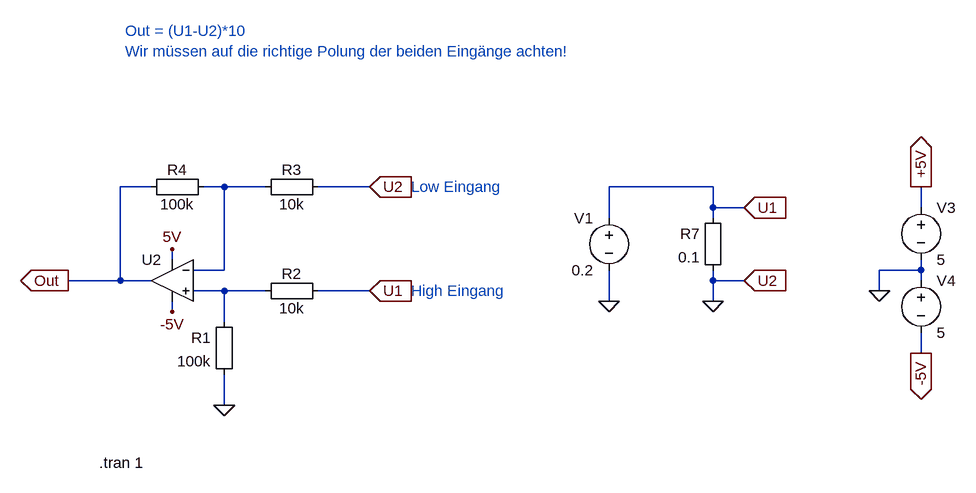
[diagram p0: schematic Differenzverstärker.asc]
Differenzverstärker.asc, the LTspice schematic file:
Version 4.1
SHEET 1 920 964
WIRE -336 -48 -384 -48
WIRE -224 -48 -256 -48
WIRE -160 -48 -224 -48
WIRE 0 -48 -80 -48
WIRE 528 -48 368 -48
WIRE 528 -16 528 -48
WIRE 576 -16 528 -16
WIRE 848 -16 848 -48
WIRE 368 0 368 -48
WIRE 528 0 528 -16
WIRE -304 64 -304 48
WIRE -224 80 -224 -48
WIRE -224 80 -272 80
WIRE 848 80 848 64
WIRE 848 80 784 80
WIRE -384 96 -384 -48
WIRE -384 96 -464 96
WIRE -336 96 -384 96
WIRE 528 96 528 80
WIRE 576 96 528 96
WIRE 848 96 848 80
WIRE -224 112 -272 112
WIRE -160 112 -224 112
WIRE 0 112 -80 112
WIRE 784 112 784 80
WIRE 368 128 368 80
WIRE 528 128 528 96
WIRE -304 144 -304 128
WIRE -224 160 -224 112
WIRE 848 208 848 176
WIRE -224 288 -224 240
FLAG -224 288 0
FLAG 784 112 0
FLAG 848 -48 +5V
IOPIN 848 -48 Out
FLAG 848 208 -5V
IOPIN 848 208 Out
FLAG -304 48 5V
FLAG -304 144 -5V
FLAG 0 112 U1
IOPIN 0 112 In
FLAG 0 -48 U2
IOPIN 0 -48 In
FLAG 528 128 0
FLAG 368 128 0
FLAG 576 -16 U1
IOPIN 576 -16 In
FLAG 576 96 U2
IOPIN 576 96 In
FLAG -464 96 Out
IOPIN -464 96 Out
SYMBOL Misc\\EuropeanResistor -208 144 M0
SYMATTR InstName R1
SYMATTR Value 100k
SYMBOL Misc\\EuropeanResistor -176 96 M90
WINDOW 0 5 56 VBottom 2
WINDOW 3 27 56 VTop 2
SYMATTR InstName R2
SYMATTR Value 10k
SYMBOL Misc\\EuropeanResistor -176 -64 M90
WINDOW 0 5 56 VBottom 2
WINDOW 3 27 56 VTop 2
SYMATTR InstName R3
SYMATTR Value 10k
SYMBOL Misc\\EuropeanResistor -352 -64 M90
WINDOW 0 5 56 VBottom 2
WINDOW 3 27 56 VTop 2
SYMATTR InstName R4
SYMATTR Value 100k
SYMBOL voltage 368 -16 M0
WINDOW 123 0 0 Left 0
WINDOW 39 0 0 Left 0
SYMATTR InstName V1
SYMATTR Value 0.2
SYMBOL OpAmps\\UniversalOpAmp -304 96 M0
SYMATTR InstName U2
SYMBOL voltage 848 -32 R0
WINDOW 123 0 0 Left 0
WINDOW 39 0 0 Left 0
SYMATTR InstName V3
SYMATTR Value 5
SYMBOL voltage 848 80 R0
WINDOW 123 0 0 Left 0
WINDOW 39 0 0 Left 0
SYMATTR InstName V4
SYMATTR Value 5
SYMBOL Misc\\EuropeanResistor 544 -16 M0
SYMATTR InstName R7
SYMATTR Value 0.1
TEXT -416 376 Left 2 !.tran 1
TEXT -376 -288 Left 2 ;Out = (U1-U2)*10\nWir müssen auf die richtige Polung der beiden Eingänge achten!
TEXT 64 -48 Left 2 ;Low Eingang
TEXT 64 112 Left 2 ;High Eingang

The netlist it stands for:
* Differenzverstärker.asc
R1 N002 0 100k
R2 N002 U1 10k
R3 N001 0 10k
R4 Out N001 100k
V1 U1 0 0.2
X§U2 N002 N001 5V -5V Out level1 Avol=1Meg GBW=10Meg Vos=0 En=0 Enk=0 In=0 Ink=0 Rin=500Meg  ; pins In+ In- V+ V- OUT
V3 +5V 0 5
V4 0 -5V 5
R7 U1 0 0.1
.tran 1
* Out = (U1-U2)*10
* Wir müssen auf die richtige Polung der beiden Eingänge achten!
* Low Eingang
* High Eingang
.lib UniversalOpAmp1.lib
.backanno
.end